# Altium project PCB_Project.PrjPcb
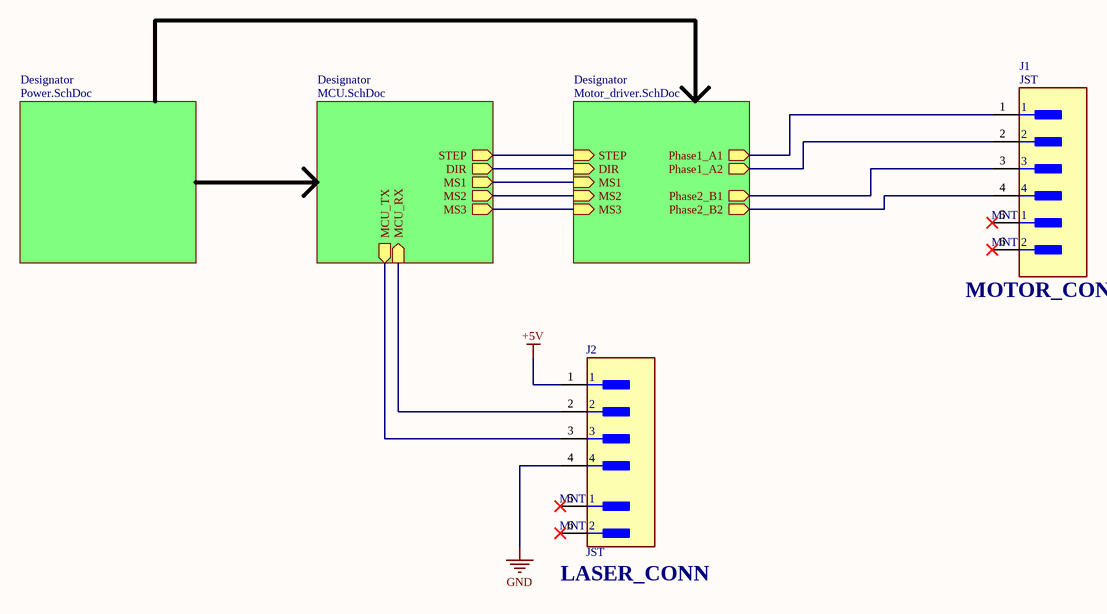
[diagram p0: TOP.SchDoc]
4 sheets, 48 parts. Net scope: hierarchical (ports join the sheet entries above them; power ports are global).
Board file: PCB2.PcbDoc
Sheets:
  TOP.SchDoc
    Designator = Power.SchDoc
    Designator = MCU.SchDoc
    Designator = Motor_driver.SchDoc

## Sheet TOP.SchDoc
size A4; SheetNumber: 1; SheetTotal: 4

### Parts
J1  Manufacturer: JST  [FP-SM04B-PASS-TBT_LF_SN-MFG]  (hidden comment: SM04B-PASS-TBT(LF)(SN))
J2  Model: JST  [FP-B4B-PH-SM4-TBT_LF_SN-MFG]  (hidden comment: B4B-PH-SM4-TBT(LF)(SN))

### Sub-sheets
Designator = Power.SchDoc: no entries
Designator = MCU.SchDoc: STEP (out), DIR (out), MS1 (out), MS2 (out), MS3 (out), MCU_RX (in), MCU_TX (out)
Designator = Motor_driver.SchDoc: STEP (in), MS1 (in), MS2 (in), MS3 (in), DIR (in), Phase1_A1 (out), Phase1_A2 (out), Phase2_B1 (out), Phase2_B2 (out)

### Nets
+5V: J2.1
GND: J2.4
NetJ1_1: J1.1 ; sheet Designator/Phase1_A1
NetJ1_2: J1.2 ; sheet Designator/Phase1_A2
NetJ1_3: J1.3 ; sheet Designator/Phase2_B1
NetJ1_4: J1.4 ; sheet Designator/Phase2_B2
NetJ2_2: J2.2 ; sheet Designator/MCU_RX
NetJ2_3: J2.3 ; sheet Designator/MCU_TX
NetU2_9: sheet Designator/DIR, sheet Designator/DIR
NetU2_10: sheet Designator/STEP, sheet Designator/STEP
NetU2_11: sheet Designator/MS3, sheet Designator/MS3
NetU2_12: sheet Designator/MS2, sheet Designator/MS2
NetU2_13: sheet Designator/MS1, sheet Designator/MS1

Not connected (* = marked no-connect by the designer): J1 5(MNT_1)* 6(MNT_2)*; J2 5(MNT_1)* 6(MNT_2)*

### Notes on the sheet
- (near J1) MOTOR_CONN
- (near J2) LASER_CONN

### Library data of the parts
J1 = CMP-2000-07078-2: CONN HEADER SMD R/A 4POS 2MM; Voltage Rating: 250V; Current Rating: 3A; Conn Gender: Male; Conn Orientation: Right Angle; Number Of Contacts: 4; Height: 5.7mm; Contact Material: Tin; Device Class L2: Headers and Wire Housings; Number Of Rows: 1; Device Class L1: Connectors; RoHS: TRUE; Lead Free: Yes; Automotive: No; Digikey Description: CONN HEADER SMD R/A 4POS 2MM; Manufacturer Part Number: SM04B-PASS-TBT(LF)(SN); Temperature: -25°C to +85°C; Package: SM04B-PASS-TBT(LF)(SN); Temperature Range Low: -25°C; ComponentLink2Description: Datasheet; Temperature Range High: +85°C; Pitch: 2mm; ComponentLink2URL: http://www.jst-mfg.com/product/pdf/eng/ePA-F.pdf; Octopart: https://octopart.com/sm04b-pass-tbt%28lf%29%28sn%29-jst-3990422; Category: Conn; Device Class L3: unset
J2 = CMP-17439-000271-1: CONN HEADER SMD 4POS 2MM; Voltage Rating: 100V; Contact Resistance: 20mR; Mated Stacking Heights: 8.6mm; Number of Positions: 4; Max Current Rating: 2A; Color: Natural; Connector Type: Header; Mount: Surface Mount; Contact Finish - Mating: TIN; Contact Material: Copper Alloy; Contact Mating Length: 0.13inch; Contact Plating: Copper; Max Operating Temperature: 85°C; Termination: Solder; Fastening Type: Detent; Min Operating Temperature: -25°C; Contact Shape: Square; Flammability Rating: UL94 V-0; Housing Material: Polyamide; Contact Type: Male Pin; Housing Color: Beige; Depth: 5mm; Packaging: Tape and Reel; Number of Rows: 1; Insulation Color: Natural; Length: 11.95mm; Max Voltage Rating (AC): 100V; Orientation: Straight; Insulation Material: Nylon; Pitch: 2mm; Package Quantity: 1; Series: PH; Lead Free: Lead Free

## Sheet Power.SchDoc
size A4; SheetNumber: 2; SheetTotal: 4
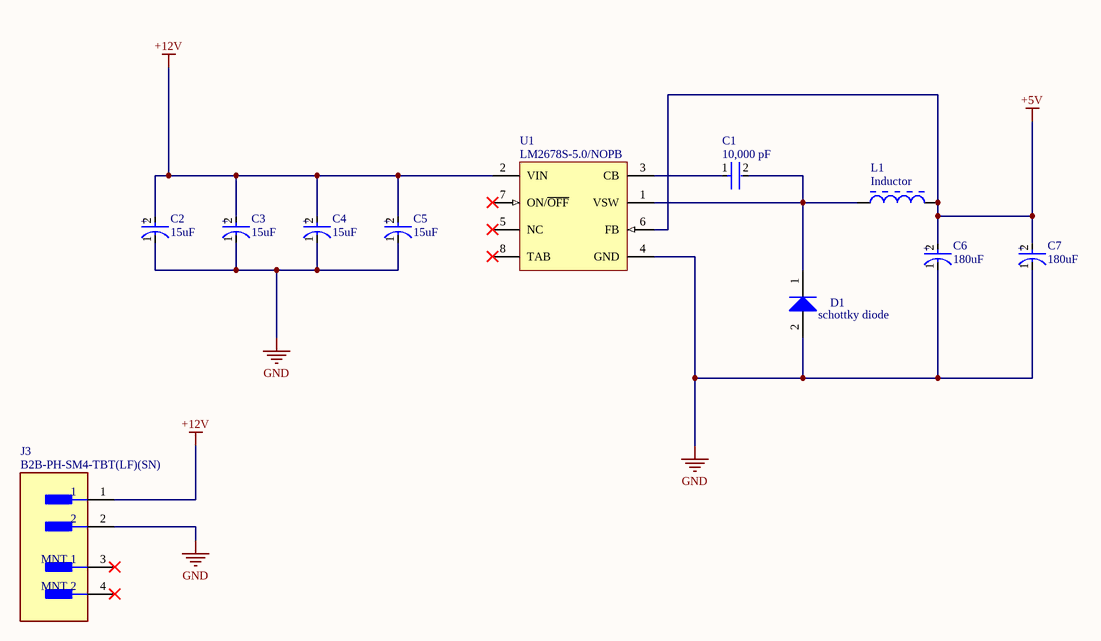
[diagram p1: Power.SchDoc]

### Parts
C1  value 10,000 pF  [FP-C0805C-DN-MFG]  (hidden comment: C0805C103K1RACTU)
C2  Capacitance: 15uF  [FP-TAJS-MFG]  (hidden comment: TAJS156K006RNJ)
C3  Capacitance: 15uF  [FP-TAJS-MFG]  (hidden comment: TAJS156K006RNJ)
C4  Capacitance: 15uF  [FP-TAJS-MFG]  (hidden comment: TAJS156K006RNJ)
C5  Capacitance: 15uF  [FP-TAJS-MFG]  (hidden comment: TAJS156K006RNJ)
C6  Capacitance: 180uF  [FP-SP-Cap-X-MFG]  (hidden comment: EEFSX0D181ER)
C7  Capacitance: 180uF  [FP-SP-Cap-X-MFG]  (hidden comment: EEFSX0D181ER)
D1  Model: schottky diode  [INF-SOD323_V]  (hidden comment: BAS3010B-03W)
J3  B2B-PH-SM4-TBT(LF)(SN)  [FP-B2B-PH-SM4-TBT_LF_SN-MFG]
L1  Model: Inductor  [BOUR-SRN3015-2_V]  (hidden comment: SRN3015-220M)
U1  LM2678S-5.0/NOPB  [KTW0007B_L]

### Nets
+5V: C6.2(A) C7.2(A) L1.2 U1.6(FB)
+12V: C2.2(A) C3.2(A) C4.2(A) C5.2(A) J3.1 U1.2(VIN)
GND: C2.1(C) C3.1(C) C4.1(C) C5.1(C) C6.1(C) C7.1(C) D1.2(A) J3.2 U1.4(GND)
NetC1_1: C1.1 U1.3(CB)
NetC1_2: C1.2 D1.1(K) L1.1 U1.1(VSW)

Not connected (* = marked no-connect by the designer): J3 3(MNT_1)* 4(MNT_2)*; U1 5(NC)* 7(ON/~{OFF})* 8(TAB)*

### Notes on the sheet
- (in symbol CMP-04424-000383-1) +
- (in symbol CMP-05428-000369-1) +

### Library data of the parts
C1 = CMP-03020-018902-1: CAP CER 10000PF 100V X7R 0805; Manufacturer: KEMET; Material: Ceramic; Temperature Coefficient: 30ppm/°C; Tolerance: 0.1; Octopart: https://octopart.com/c0805c103k1ractu-kemet-97824; Capacitance: 10,000 pF; Ipc Land Pattern Name: CAPC200125X78; Temperature: -55°C to +125°C; Temperature Range High: +125°C; Temperature Range Low: -55°C; Category: Cap; Voltage Rating: 100 V; ComponentLink2Description: Datasheet; Device Class L3: Ceramic Capacitors; ComponentLink2URL: https://content.kemet.com/datasheets/KEM_C1003_C0G_SMD.pdf; Automotive: No; Temperature Characteristic: X7R; Digikey Description: CAP CER 10000PF 100V X7R 0805; Package: C0805C-DN; Height: 0.88mm; Device Class L2: Capacitors; Mouser Description: Cap Ceramic 0.01uF 100V X7R 10% SMD 0805 125°C Paper T/R; Device Class L1: Passive Components; Lead Free: Yes; RoHS: TRUE; Manufacturer Part Number: C0805C103K1RACTU
C2-C5 = CMP-04424-000383-1: 15uF 6.3V  ±10% 3.5Ω 1206  SMD Tantalum Capacitor; Dissipation Factor: 8%; Leakage Current: 900nA; Polarity: Polar; ESR (Equivalent Series Resistance): 4R; Voltage Rating (DC): 6.3V; Weight: 0.000571oz; Max Operating Temperature: 125°C; Voltage Rating: 6.3V; Number of Pins: 2; Construction: Flat; Termination: SMD/SMT; Depth: 1.6mm; Width: 0.063inch; Series: TAJ; Packaging: Tape and Reel; Package Quantity: 1; Case Code (Imperial): 1206; Tolerance: 10%; Radiation Hardening: No; Features: General Purpose; Min Operating Temperature: -55°C; Height - Seated (Max): 0.047inch; RoHS Compliant: Yes; Length: 3.2mm; Case Code (Metric): 3216; Case/Package: 1206; Dielectric Material: Tantalum; Height: 1.2mm; Lead Free: Lead Free; Mount: Surface Mount; Voltage: 6.3V; Resistance: 4R
C6 C7 = CMP-05428-000369-1: Molded Aluminum Polymer Capacitor 180uF 20% 2V life 2000Hours SMD 2917; ESR (Equivalent Series Resistance): 9mR; Life (Hours): 1000Hour; Ripple Current: 3A; Dielectric Material: Aluminium; Dissipation Factor: 0.06%; Leakage Current: 36uA; Max Operating Temperature: 105°C; Packaging: Tape and Reel; Case Code (Metric): 7343; Package Quantity: 3500; Voltage Rating (DC): 2V; Mount: Surface Mount; RoHS Compliant: Yes; Termination: SMD/SMT; Depth: 4.3mm; Voltage: 2V; Series: SP-Cap SX; Ripple Current (AC): 3A; Height - Seated (Max): 0.083inch; Voltage Rating: 2V; Length: 7.3mm; Construction: Flat; Case Code (Imperial): 2917; Min Operating Temperature: -40°C; Height: 1.9mm; Number of Pins: 2; Case/Package: 2917; Width: 4.3mm; Tolerance: 20%
D1 = CMP-1183-00005-1: Medium Power AF Schottky Diode, -65 to 125 degC, SOD323, Reel, Green; Manufacturer: Infineon; CT (max): 40Â pF; Configuration: Single; VR (max): 30Â V; Green: TRUE; IF (max): 1,000Â mA; VF (max): 550Â mV; PackageReference: SOD323; ComponentLink1URL: http://www.infineon.com/; ComponentLink1Description: Manufacturer URL; Mounting Technology: Surface Mount; Packing: Reel; ComponentLink3Description: Package Specification; PackageDescription: 2-Pin Small Outline Diode Package, 1.25 x 1.7 mm Body; ComponentLink2Description: Datasheet; ComponentLink3URL: http://www.infineon.com/dgdl/SOD323-Package_Overview.pdf?folderId=db3a30431936bc4b011952aab84f3bbe&fileId=db3a30431936bc4b011952beed653be3; ComponentLink2URL: http://www.infineon.com/dgdl/bas3010bseries.pdf?folderId=db3a304313d846880113def5812204a1&fileId=db3a304313e278750113e29a03a70005; PartNumber: BAS3010B-03W
J3 = CMP-17439-000005-1: CONN HEADER SMD 2POS 2MM; Manufacturer: JST; Current Rating: 2A; Conn Gender: Male; Voltage Rating: 100V; Conn Orientation: Vertical; Number Of Contacts: 2; Octopart: https://octopart.com/b2b-ph-sm4-tbt%28lf%29%28sn%29-jst-7877930; Number Of Rows: 1; Device Class L2: Headers and Wire Housings; RoHS: TRUE; Contact Material: Tin,Copper; Height: 6.65mm; Temperature: -25°C to +85°C; Temperature Range Low: -25°C; ComponentLink2Description: Datasheet; Manufacturer Part Number: B2B-PH-SM4-TBT(LF)(SN); ComponentLink2URL: http://www.jst-mfg.com/product/pdf/eng/ePH.pdf; Automotive: No; Pitch: 2mm; Lead Free: Yes; Device Class L3: unset; Category: Conn; Digikey Description: CONN HEADER SMD 2POS 2MM; Temperature Range High: +85°C; Package: 0; Device Class L1: Connectors
L1 = CMP-0007-00013-1: Semi-shielded Power Inductor, 22 uH, +/- 20%, 0.6 A, -40 to 125 degC, 3 x 3 x 1.5 mm SMD, RoHS and Halogen Free, Tape and Reel; Manufacturer: Bourns; SRF Min: 28 MHz; Isat: 0.58 A; Resistance to Solder Heat: +260 degC for 10 sec.; Inductance tolerance: +/- 20%; Inductance: 22 uH; Rated current: 0.6 A; DCR Max: 0.622 Ohm; RoHS: TRUE; ComponentLink1Description: Manufacturer URL; ComponentLink3URL: http://www.bourns.com/data/global/pdfs/SRN3015.pdf; PartNumber: SRN3015-220M; DatasheetVersion: Aug-11; Mounting Technology: Surface Mount; ComponentLink3Description: Package Specification; ComponentLink2Description: Datasheet; Operating Temperature: -40 to 125 degC; PackageDescription: 2-Pin SMD, Body 3 x 3 mm, Height 1.5 mm; Packing: Tape and Reel; PackageReference: SRN3015; ComponentLink2URL: http://www.bourns.com/data/global/pdfs/SRN3015.pdf; ComponentLink1URL: http://www.bourns.com/
U1 = CMP-0069-00189-3: SIMPLE SWITCHER® High Efficiency 5A Step-Down Voltage Regulator, 7-pin TO-263, Pb-Free; Manufacturer: Texas Instruments; PackageTopMarking: NSUZXYTTE#*LM2678*S-5.0; PowerWise: N; PackageReference: KTW0007B; RoHS: Y; ComponentLink1URL: http://www.ti.com/general/docs/lit/getliterature.tsp?genericPartNumber=LM2678&fileType=pdf; ComponentLink1Description: Datasheet URL; PackageDescription: TO-263, Molded, .400 x .390 x .180in Body, 7 Lead, .050in Pitch, Surface Mount; Code_JEDEC: MO-169-AC; PinCount: 7; CompType: Switcher

## Sheet MCU.SchDoc
size A4; SheetNumber: 4; SheetTotal: 4
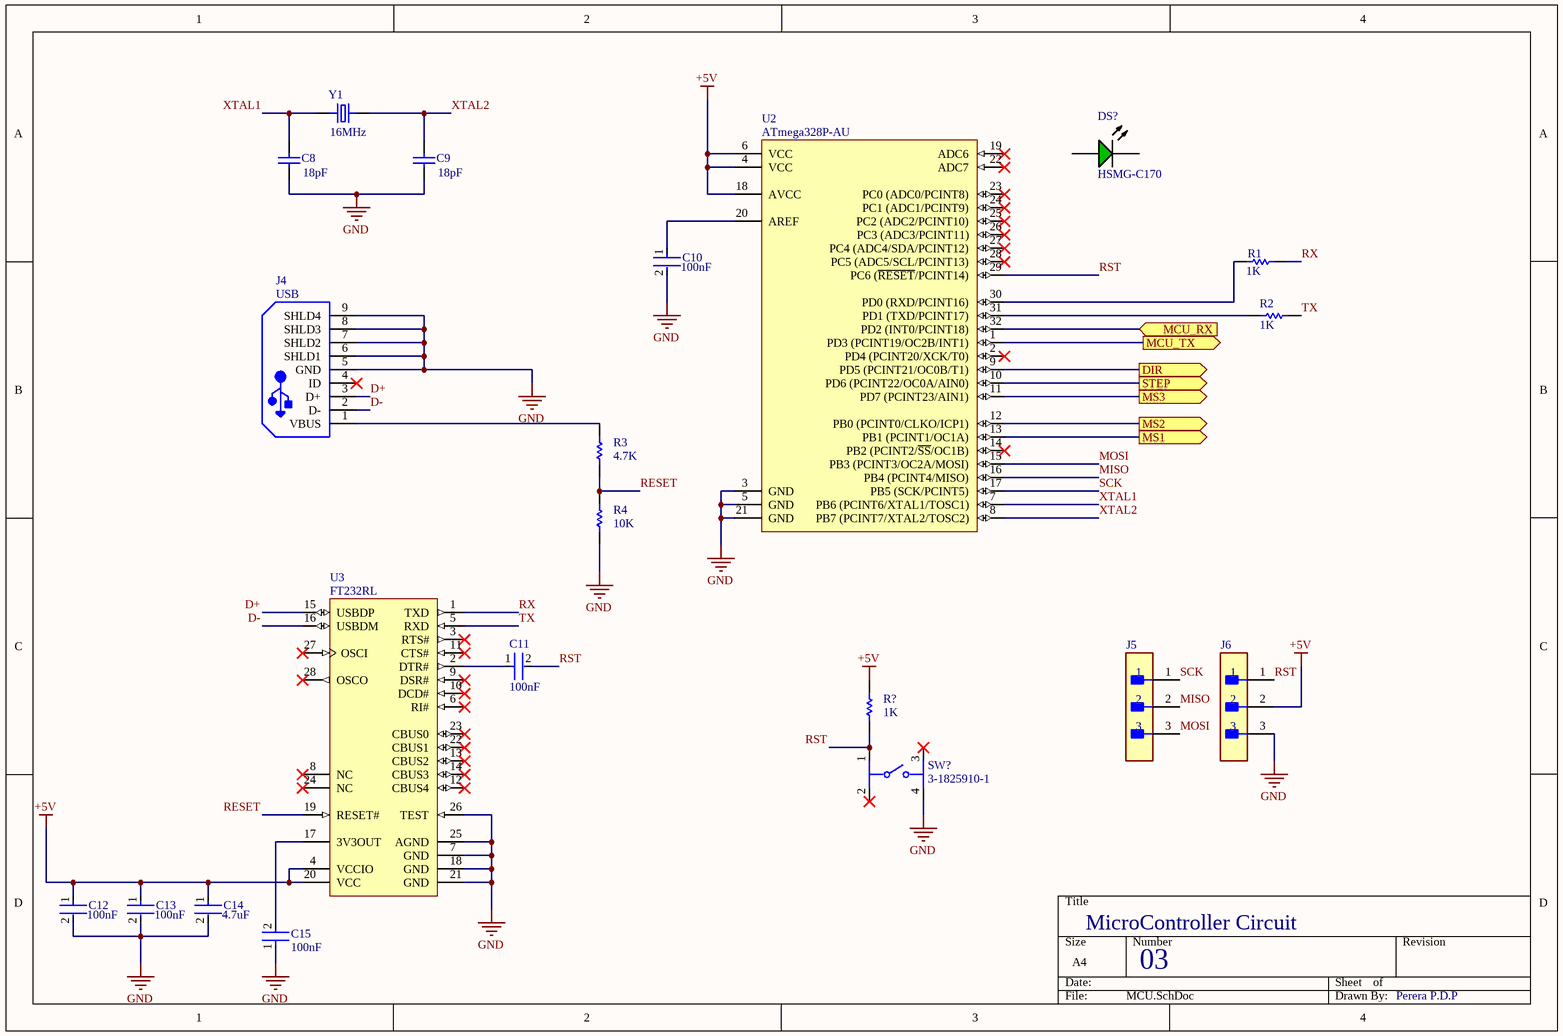
[diagram p2: MCU.SchDoc]

### Parts
C8  value 18pF  [CAPC2013X115X51ML20T26]  (hidden comment: 08052U180GAT2A)
C9  value 18pF  [CAPC2013X115X51ML20T26]  (hidden comment: 08052U180GAT2A)
C10  Capacitance: 100nF  [FP-0805-L_2_01_0_2-W_1_25-IPC_B]  (hidden comment: 08051C104KAT2A)
C11  Capacitance: 100nF  [FP-0805-L_2_01_0_2-W_1_25-IPC_B]  (hidden comment: 08051C104KAT2A)
C12  Capacitance: 100nF  [FP-0805-L_2_01_0_2-W_1_25-IPC_B]  (hidden comment: 08051C104KAT2A)
C13  Capacitance: 100nF  [FP-0805-L_2_01_0_2-W_1_25-IPC_B]  (hidden comment: 08051C104KAT2A)
C14  Capacitance: 4.7uF  [FP-0805-L_2_01_0_2-W_1_25-MFG]  (hidden comment: 0805YC475KAT2A)
C15  Capacitance: 100nF  [FP-0805-L_2_01_0_2-W_1_25-IPC_B]  (hidden comment: 08051C104KAT2A)
DS?  HSMG-C170  [AVAG-HSMX-C170_V]
J4  Model: USB  [MOLX-56579-0576_V]  (hidden comment: 56579-0576)
J5  NRPN031PAEN-RC  [FP-NRPN031PAEN-RC-MFG]  (value not drawn)
J6  NRPN031PAEN-RC  [FP-NRPN031PAEN-RC-MFG]  (value not drawn)
R1  value 1K  [RESC2013X60X35NL10T20]  (hidden comment: RT0805BRD071KL)
R2  value 1K  [RESC2013X60X35NL10T20]  (hidden comment: RT0805BRD071KL)
R3  value 4.7K  [RESC2013X60X40ML20T25]  (hidden comment: ERA6AEB472V)
R4  value 10K  [RESC2013X60X40NL15T20]  (hidden comment: CRCW080510K0FKEAHP)
R?  value 1K  [RESC2013X60X35NL10T20]  (hidden comment: RT0805BRD071KL)
SW?  3-1825910-1  [FP-3-1825910-1-MFG]
U2  ATmega328P-AU  [32A_M]
U3  FT232RL  [FTDI-SSOP-28_M]
Y1  value 16MHz  [XTAL_ECS-160-S-5PX-TR]  (hidden comment: ECS-160-S-5PX-TR)

### Ports
DIR (out, see TOP[2B], Motor_driver[1B]), MCU_RX (in, see TOP[2C]), MCU_TX (out, see TOP[2C]), MS1 (out, see TOP[2B], Motor_driver[1B]), MS2 (out, see TOP[2B], Motor_driver[1B]), MS3 (out, see TOP[2B], Motor_driver[1B]), STEP (out, see TOP[2B], Motor_driver[1B])

### Nets
+5V: C12.1 C13.1 C14.1 J6.2 R?.2 U2.4(VCC) U2.6(VCC) U2.18(AVCC) U3.4(VCCIO) U3.20(VCC)
GND: C8.1 C9.1 C10.2 C12.2 C13.2 C14.2 C15.1 J4.5(GND) J4.6(SHLD1) J4.7(SHLD2) J4.8(SHLD3) J4.9(SHLD4) J6.3 R4.1 SW?.4 U2.3(GND) U2.5(GND) U2.21(GND) U3.7(GND) U3.18(GND) U3.21(GND) U3.25(AGND) U3.26(TEST)
D+: J4.3(D+) U3.15(USBDP)
D-: J4.2(D-) U3.16(USBDM)
MISO: J5.2 U2.16(PB4_(PCINT4/MISO))
MOSI: J5.3 U2.15(PB3_(PCINT3/OC2A/MOSI))
RESET: R3.1 R4.2 U3.19(RESET#)
RST: C11.2 J6.1 R?.1 SW?.1 U2.29(PC6_(~{RESET}/PCINT14))
RX: R1.1 U3.1(TXD)
SCK: J5.1 U2.17(PB5_(SCK/PCINT5))
TX: R2.1 U3.5(RXD)
XTAL1: C8.2 U2.7(PB6_(PCINT6/XTAL1/TOSC1)) Y1.1
XTAL2: C9.2 U2.8(PB7_(PCINT7/XTAL2/TOSC2)) Y1.2
NetC10_1: C10.1 U2.20(AREF)
NetC11_1: C11.1 U3.2(DTR#)
NetC15_2: C15.2 U3.17(3V3OUT)
NetJ2_2: U2.32(PD2_(INT0/PCINT18)) ; port MCU_RX
NetJ2_3: U2.1(PD3_(PCINT19/OC2B/INT1)) ; port MCU_TX
NetJ4_1: J4.1(VBUS) R3.2
NetR1_2: R1.2 U2.30(PD0_(RXD/PCINT16))
NetR2_2: R2.2 U2.31(PD1_(TXD/PCINT17))
NetU2_9: U2.9(PD5_(PCINT21/OC0B/T1)) ; port DIR
NetU2_10: U2.10(PD6_(PCINT22/OC0A/AIN0)) ; port STEP
NetU2_11: U2.11(PD7_(PCINT23/AIN1)) ; port MS3
NetU2_12: U2.12(PB0_(PCINT0/CLKO/ICP1)) ; port MS2
NetU2_13: U2.13(PB1_(PCINT1/OC1A)) ; port MS1

Not connected (* = marked no-connect by the designer): DS? 1(A) 2(K); J4 4(ID)*; SW? 2* 3*; U2 2(PD4_(PCINT20/XCK/T0))* 14(PB2_(PCINT2/~{SS}/OC1B))* 19(ADC6)* 22(ADC7)* 23(PC0_(ADC0/PCINT8))* 24(PC1_(ADC1/PCINT9))* 25(PC2_(ADC2/PCINT10))* 26(PC3_(ADC3/PCINT11))* 27(PC4_(ADC4/SDA/PCINT12))* 28(PC5_(ADC5/SCL/PCINT13))*; U3 3(RTS#)* 6(RI#)* 8(NC)* 9(DSR#)* 10(DCD#)* 11(CTS#)* 12(CBUS4)* 13(CBUS2)* 14(CBUS3)* 22(CBUS1)* 23(CBUS0)* 24(NC)* 27(OSCI)* 28(OSCO)*

### Notes on the sheet
- MicroController Circuit
- 03
- Perera P.D.P

### Library data of the parts
C8 C9 = CMP-2007-04887-1: Manufacturer: AVX Interconnect / Elco; Part Number: 08052U180GAT2A
C10-C13 C15 = CMP-2007-04174-2: General Purpose Ceramic Capacitor, 0805, 100nF, 10%, X7R, 15%, 100V; Packaging: Tape and Reel; Min Operating Temperature: -55°C; Dielectric Material: Ceramic; Height: 1.4mm; Voltage Rating: 100V; Termination: SMD/SMT; Case Code (Imperial): 0805; Case Code (Metric): 2012; Case/Package: 0805; Construction: Flat; Radiation Hardening: No; Series: -; Dielectric: X7R; Package Quantity: 2000; Mount: Surface Mount; Contact Plating: Tin; Voltage: 100V; Lead Free: Lead Free; Depth: 1.25mm; RoHS Compliant: Yes; Number of Pins: 2; Max Operating Temperature: 125°C; Length: 2.01mm; Voltage Rating (DC): 100V; Thickness: 0.055inch; REACH SVHC: No SVHC; Width: 0.049inch; Tolerance: 10%
C14 = CMP-2007-04518-2: General Purpose Ceramic Capacitor, 0805, 4.7uF, 10%, X7R, 15%, 16V; Dissipation Factor: 3.5%; Voltage: 10V; Height: 1.52mm; Package Quantity: 1; Voltage Rating: 16V; RoHS Compliant: Yes; Mount: Surface Mount; REACH SVHC: No SVHC; Number of Pins: 2; Packaging: Tape and Reel; Radiation Hardening: No; Thickness: 0.06inch; Width: 0.049inch; Length: 2.01mm; Termination: SMD/SMT; Case Code (Metric): 2012; Max Operating Temperature: 125°C; Construction: Flat; Series: -; Depth: 1.25mm; Voltage Rating (DC): 16V; Dielectric: X7R; Contact Plating: Tin; Tolerance: 10%; Lead Free: Lead Free; Min Operating Temperature: -55°C; Case Code (Imperial): 0805; Case/Package: 0805; Value: *
DS? = CMP-2000-05062-1: Chip LED, Green, 2.2 V, -40 to 85 degC, 2-Pin SMD, Pb-Free, Tape and Reel; Manufacturer: Avago; No. of Pins: 2; Peak Wavelength: 570nm; SVHC: NoSVHC(16-Jun-2014); Dominant Wavelength: 572nm; Forward Current If: 20mA; Viewing Angle: 170deg; Lens Shape: Rectangular; PIV Max: 5V; External Width: 1.25mm; LED Type: Standard; External Depth: 0.8mm; Opto Mounting Orientation: Top; Luminous Intensity: 15mcd; Luminous Intensity Min: 4mcd; Forward Voltage VF Max: 2.6V; External Length / Height: 2mm; Bulb Size: 1.25mmx1.4mm; Light Area Height: 1mm; Voltage Vf Typ: 2.2V; Operating Temperature Max: 85degC; Datasheet Version: Oct-08; MSL: MSL2A-4weeks; Peak Forward Current: 20mA; Package Description: 2-Pin Surface Mount Device, Body 2 x 1.25 mm, Height 0.8 mm; Datasheet URL: https://datasheet.ciiva.com/29280/180495-da-01-en-chip-led-hsmg-c170-gelb-gruen-29280971.pdf; Storage Temperature Min: -40degC; LED Colour: Green; Wavelength Typ: 570nm; Mounting Type: SMD; Forward Current If Max: 20mA; Dominant Wavelength Typ: 572nm; LED Mounting: SMD; Operating Temperature Range: -30degCto+85degC; Operating Temperature Min: -30degC; Manufacturer URL: http://www.avagotech.com/; Packaging: CutTape; Luminous Intensity Typ: 15mcd; Package Reference: HSMX-C170; Storage Temperature Max: 85degC; Opto Case Style: SMD; Forward Voltage: 2.2V
J4 = CMP-2000-05643-1: USB Connector, 30 V, 1 A, 0 to 50 degC, 5-Pin SMD, RoHS, Tape and Reel; Brand: Molex; Insulation Resistance: 100MOhms; Connector Type: MiniUSBTypeABReceptacle; Mounting Angle: Right; Number of Ports: 1Port; Gender: Female; Voltage Rating: 30VAC/DC; Number of Contacts: 5Contact; Current Rating: 1A; Package Reference: 56579-0576; Package Description: 5-Pin Surface Mount Device, Body 9.9 x 9 mm, Pitch 0.8 mm; Color: Gray; Manufacturer URL: http://www.molex.com/; Product: MiniUSBTypeABConnectors; Factory Pack Quantity: 800; Standard: USB; Termination Style: SolderTab; Contact Plating: Gold; Product Category: USBConnectors; Datasheet Version: Rev. E, 04/2006; Operating Temperature Range: 0Cto+50C; RoHS: Details; Manufacturer: Molex; Features: MetalshieldingforESDprotection; Mounting Technology: SurfaceMount; Flammability Rating: UL94V-0; Datasheet URL: http://www.molex.com/pdm_docs/sd/565790576_sd.pdf; Series: 56579; Contact Material: CopperAlloy; Packaging: Reel
J5 J6 = CMP-25680-000021-1: CONN HEADER VERT 3POS 2MM; Manufacturer: Sullins; Number Of Contacts: 3; Conn Orientation: Straight; Voltage Rating: 150V; Conn Gender: Male; Current Rating: 2A; Temperature Range High: +105°C; Category: Conn; Manufacturer Part Number: NRPN031PAEN-RC; RoHS: TRUE; Contact Material: Gold,Nickel; ComponentLink2URL: https://drawings-pdf.s3.amazonaws.com/10531.pdf; Temperature: -40°C to +105°C; Lead Free: Yes; Octopart: https://octopart.com/nrpn031paen-rc-sullins-12817732; ComponentLink2Description: Datasheet; Pitch: 2mm; Number Of Rows: 1; Automotive: No; Height: 6mm; Device Class L2: Headers and Wire Housings; Digikey Description: CONN HEADER VERT 3POS 2MM; Package: 0; Device Class L3: unset; Temperature Range Low: -40°C; Device Class L1: Connectors
R1 R2 R? = CMP-2001-01453-1: Manufacturer: Yageo; Part Number: RT0805BRD071KL
R3 = CMP-2001-00644-1: Manufacturer: Panasonic; Part Number: ERA6AEB472V
R4 = CMP-2001-04472-1: Manufacturer: Vishay Dale; Part Number: CRCW080510K0FKEAHP
SW? = CMP-03407-000001-1: SWITCH TACTILE SPST-NO 0.05A 24V; Manufacturer: TE Connectivity; Operating Force: 160gf; Contact Current Rating: 50mA; Description: Switch Tactile OFF (ON) SPST Round Button PC Pins 0.05A 24VDC 100000Cycles 1.57N Thru-Hole; Contact Resistance: 100mΩ; Electromechanical Life: 100000Cycles; Device Class L1: Electromechanical; ComponentLink2URL: https://www.te.com/commerce/DocumentDelivery/DDEController?Action=srchrtrv&DocNm=1825910&DocType=Customer+Drawing&DocLang=English; Category: Switch; Device Class L2: Switches; Temperature: -35°C to +85°C; RoHS: TRUE; Mount: Through Hole; Manufacturer Part Number: 3-1825910-1; Automotive: No; Lead Free: Yes; Device Class L3: Tactile Switches; ComponentLink2Description: Datasheet; Temperature Range High: +85°C; Height: 17.3mm; Package: 0; Temperature Range Low: -35°C; Throw Configuration: SPST-NO; Digikey Description: SWITCH TACTILE SPST-NO 0.05A 24V; Octopart: https://octopart.com/3-1825910-1-te+connectivity-46506874
U2 = CMP-0095-00269-2: 8-bit AVR Microcontroller, 32KB Flash, 1KB EEPROM, 2KB SRAM, 32-pin TQFP, Industrial Grade (-40°C to 85°C); PackageDescription: 32-Lead, 7x7x1.0 mm Body, 0.8mm Lead Pitch, Thin Profile Plastic Quad Flat Package (TQFP); DatasheetVersion: revD, May-2011; RevisionNote: DatasheetVersion & PackageVersion updated. URLs added.; ComponentLink1URL: http://www.atmel.com/; ComponentLink2Description: ATmega48A/48PA/88A/88PA/168A/168PA/328/328P Datasheet; Code_JEDEC: MS-026-ABA; ComponentLink1Description: Manufacturer URL; PackageReference: 32A; ComponentLink3Description: ATmega48A/48PA/88A/88PA/168A/168PA/328/328P Summary; ComponentLink2URL: http://www.atmel.com/dyn/resources/prod_documents/doc8271.pdf; PackageVersion: revC, Oct-2010; ComponentLink3URL: http://www.atmel.com/dyn/resources/prod_documents/8271S.pdf
U3 = CMP-2000-05029-1: IC USB FS SERIAL UART 28-SSOP; Manufacturer: FTDI; Receive FIFO: 256B; Number of Channels per Chip: 1; Maximum Data Rate: 3MBd; Transmit FIFO: 128B; Dimensions: 10.2x5.3x1.75mm; Mounting Type: SurfaceMount; Height: 1.75mm; Package Type: SSOP; Datasheet Version: Rev. 1.04, 02/2006; Width: 5.3mm; Manufacturer URL: http://www.ftdichip.com/; Datasheet URL: http://datasheet.octopart.com/FT232RL-FTDI-datasheet-120501.pdf; Maximum Operating Temperature: +85degC; Minimum Operating Temperature: -40degC; Pin Count: 28; Length: 10.2mm
Y1 = ECS-160-S-5PX-TR: 16MHz Â±30ppm Crystal Series 40 Ohms HC-49/US; MF: ECS Inc.; MP: ECS-160-S-5PX-TR; Package: HC49/US ECS International; Price: None; Availability: Unavailable; SnapEDA_Link: https://www.snapeda.com/parts/ECS-160-S-5PX-TR/ECS%20Inc./view-part/2457269/?ref=snap; Parameter 1: *

## Sheet Motor_driver.SchDoc
size A4; SheetNumber: 3; SheetTotal: 4
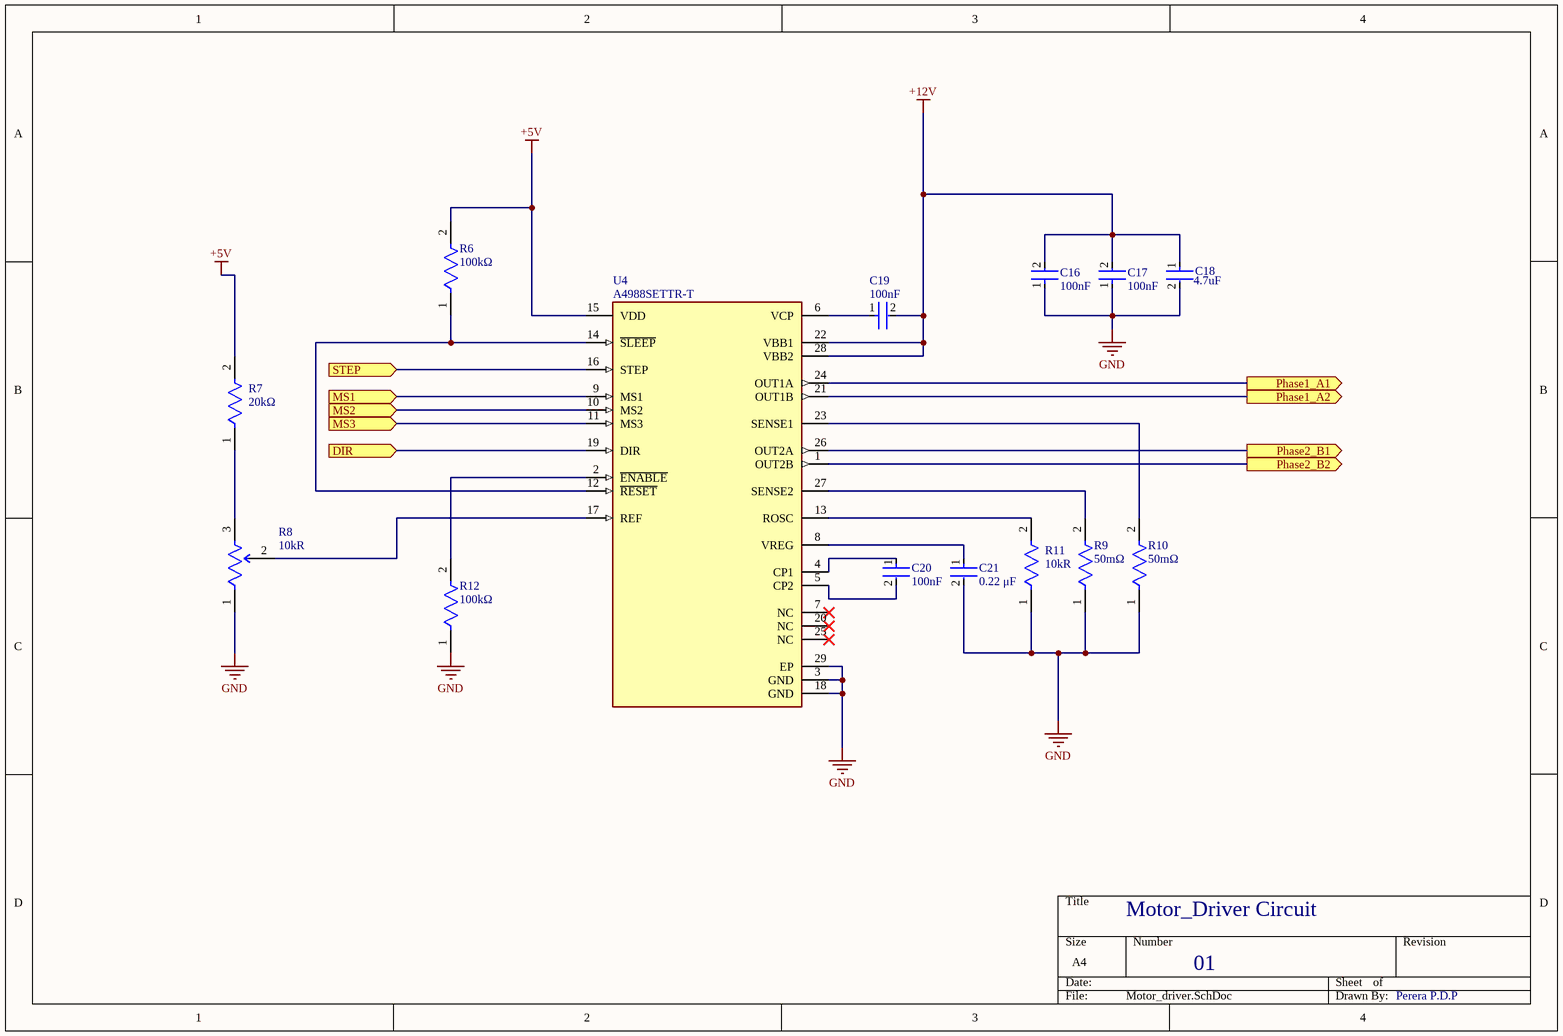
[diagram p3: Motor_driver.SchDoc]

### Parts
C16  Capacitance: 100nF  [FP-0805-L_2_01_0_2-W_1_25-IPC_C]  (hidden comment: 08055C104KAT2A)
C17  Capacitance: 100nF  [FP-0805-L_2_01_0_2-W_1_25-IPC_C]  (hidden comment: 08055C104KAT2A)
C18  Capacitance: 4.7uF  [FP-0805-L_2_01_0_2-W_1_25-MFG]  (hidden comment: 0805YC475KAT2A)
C19  Capacitance: 100nF  [FP-0805-L_2_01_0_2-W_1_25-IPC_C]  (hidden comment: 08055C104KAT2A)
C20  Capacitance: 100nF  [FP-0805-L_2_01_0_2-W_1_25-IPC_C]  (hidden comment: 08055C104KAT2A)
C21  value 0.22 μF  [FP-C0805C-DN-MFG]  (hidden comment: C0805C224K5RACTU)
R6  Resistance: 100kΩ  [FP-RC0805-0_6-IPC_C]  (hidden comment: RC0805FR-07100KL)
R7  Resistance: 20kΩ  [FP-ERA6A-MFG]  (hidden comment: ERA6AEB203V)
R8  Resistance: 10kR  [FP-3361P-MFG]  (hidden comment: 3361P-1-103GLF)
R9  Resistance: 50mΩ  [FP-WSL2512-MFG]  (hidden comment: WSL2512R0500FEA)
R10  Resistance: 50mΩ  [FP-WSL2512-MFG]  (hidden comment: WSL2512R0500FEA)
R11  Resistance: 10kR  [FP-CRCW0805-e3-IPC_A]  (hidden comment: CRCW080510K0FKEA)
R12  Resistance: 100kΩ  [FP-RC0805-0_6-IPC_C]  (hidden comment: RC0805FR-07100KL)
U4  A4988SETTR-T  [FP-ET-28-MFG]

### Ports
DIR (in, see TOP[3B], MCU[3B]), MS1 (in, see TOP[3B], MCU[3B]), MS2 (in, see TOP[3B], MCU[3B]), MS3 (in, see TOP[3B], MCU[3B]), Phase1_A1 (out, see TOP[3B]), Phase1_A2 (out, see TOP[3B]), Phase2_B1 (out, see TOP[3B]), Phase2_B2 (out, see TOP[3B]), STEP (in, see TOP[3B], MCU[3B])

### Nets
+5V: R6.2 R7.2 U4.15(VDD)
+12V: C16.2 C17.2 C18.1 C19.2 U4.22(VBB1) U4.28(VBB2)
GND: C16.1 C17.1 C18.2 C21.2 R8.1(CCW) R9.1 R10.1 R11.1 R12.1 U4.3(GND) U4.18(GND) U4.29(EP)
NetC19_1: C19.1 U4.6(VCP)
NetC20_1: C20.1 U4.4(CP1)
NetC20_2: C20.2 U4.5(CP2)
NetC21_1: C21.1 U4.8(VREG)
NetJ1_1: U4.24(OUT1A) ; port Phase1_A1
NetJ1_2: U4.21(OUT1B) ; port Phase1_A2
NetJ1_3: U4.26(OUT2A) ; port Phase2_B1
NetJ1_4: U4.1(OUT2B) ; port Phase2_B2
NetR6_1: R6.1 U4.12(~{RESET}) U4.14(~{SLEEP})
NetR7_1: R7.1 R8.3(CW)
NetR8_2: R8.2(WIPER) U4.17(REF)
NetR9_2: R9.2 U4.27(SENSE2)
NetR10_2: R10.2 U4.23(SENSE1)
NetR11_2: R11.2 U4.13(ROSC)
NetR12_2: R12.2 U4.2(~{ENABLE})
NetU2_9: U4.19(DIR) ; port DIR
NetU2_10: U4.16(STEP) ; port STEP
NetU2_11: U4.11(MS3) ; port MS3
NetU2_12: U4.10(MS2) ; port MS2
NetU2_13: U4.9(MS1) ; port MS1

Not connected (* = marked no-connect by the designer): U4 7(NC)* 20(NC)* 25(NC)*

### Notes on the sheet
- Motor_Driver Circuit
- 01
- Perera P.D.P

### Library data of the parts
C16 C17 C19 C20 = CMP-2000-05016-2: General Purpose Ceramic Capacitor, 0805, 100nF, 10%, X7R, 0.15, 50V; Dissipation Factor: 2.5%; Insulation Resistance: 100GR; Voltage Rating (DC): 50V; Package Quantity: 4000; Tolerance: 10%; Voltage Rating: 50V; Dielectric: X7R; Case/Package: 0805; Lead Free: Lead Free; Dielectric Material: Ceramic; Thickness: 0.037inch; Weight: 0.001411oz; Max Operating Temperature: 125°C; REACH SVHC: No SVHC; Mount: Surface Mount; RoHS Compliant: Yes; Depth: 1.25mm; Height: 0.5mm; Case Code (Metric): 2012; Length: 2mm; Termination: Standard; Case Code (Imperial): 0805; Number of Pins: 2; Voltage: 50V; Radiation Hardening: No; Min Operating Temperature: -55°C; Width: 1.2mm; Series: MLCC X7R; Packaging: Cut Tape
C18 = CMP-2007-04518-2: as C14 on sheet MCU; Height: 1.52mm; Package Quantity: 1; Voltage Rating: 16V; RoHS Compliant: Yes; Mount: Surface Mount; REACH SVHC: No SVHC; Number of Pins: 2; Packaging: Tape and Reel; Radiation Hardening: No; Thickness: 0.06inch; Width: 0.049inch; Length: 2.01mm; Termination: SMD/SMT; Case Code (Metric): 2012; Max Operating Temperature: 125°C; Construction: Flat; Series: -; Depth: 1.25mm; Voltage Rating (DC): 16V; Dielectric: X7R; Contact Plating: Tin; Tolerance: 10%; Lead Free: Lead Free; Min Operating Temperature: -55°C; Case Code (Imperial): 0805; Case/Package: 0805
C21 = CMP-1036-04552-2: CAP CER 0.22UF 50V X7R 0805; Manufacturer: KEMET; Temperature Coefficient: 30ppm/°C; Material: Ceramic; Tolerance: 0.1; ComponentLink2URL: https://content.kemet.com/datasheets/KEM_C1003_C0G_SMD.pdf; Temperature Characteristic: X7R; Device Class L3: Ceramic Capacitors; Lead Free: Yes; Temperature: -55°C to +125°C; RoHS: TRUE; Capacitance: 0.22 μF; Automotive: No; Octopart: https://octopart.com/c0805c224k5ractu-kemet-144670; Manufacturer Part Number: C0805C224K5RACTU; Temperature Range Low: -55°C; Height: 0.88mm; Device Class L1: Passive Components; Digikey Description: CAP CER 0.22UF 50V X7R 0805; ComponentLink2Description: Datasheet; Mouser Description: CAP CER 0.22UF 50V X7R 0805; Category: Cap; Ipc Land Pattern Name: CAPC200125X78; Temperature Range High: +125°C; Package: C0805C-DN; Device Class L2: Capacitors; Voltage Rating: 50 V
R6 R12 = CMP-2100-03668-5: RES 100K OHM 1% 1/8W 0805; Power Rating: 125mW; Temperature Coefficient: 100ppm/°C; Voltage Rating (DC): 150V; Package Quantity: 1; Case/Package: 0805; Lead Pitch: 0.4mm; Case Code (Imperial): 0805; Construction: Rectangular; Number of Terminations: 2; RoHS Compliant: Yes; Max Power Dissipation: 125mW; Tolerance: 1%; Max Operating Temperature: 155°C; Resistance Tolerance: 1%; Lead Free: Lead Free; Packaging: Tape and Reel; Resistor Type: Thick Film; Min Operating Temperature: -55°C; Case Code (Metric): 2012; Series: RC; Technology: THICK FILM; Voltage Rating: 150V; Termination: SMD/SMT; Width: 0.049inch; Number of Pins: 2; Features: Moisture Resistant; Military Standard: Not; Length: 0.079inch; Depth: 1.25mm; Size Code: 0805; Height: 0.024inch
R7 = CMP-2001-00610-2: RES 20K OHM 0.1% 1/8W 0805; Power Rating: 125mW; Voltage Rating (DC): 100V; Temperature Coefficient: 25ppm/°C; REACH SVHC: No SVHC; Features: Automotive AEC-Q200; Tolerance: 0.1%; Size Code: 0805; Max Power Dissipation: 125mW; Termination: SMD/SMT; Package Quantity: 1; Resistor Type: Thin Film; Number of Pins: 2; Width: 1.25mm; Technology: THIN FILM; Min Operating Temperature: -55°C; Length: 2mm; Mount: Surface Mount; Height: 0.5mm; Resistance Tolerance: 0.1%; Military Standard: Not; Case Code (Imperial): 0805; Contact Plating: Tin; Case Code (Metric): 2012; Number of Terminations: 2; RoHS Compliant: Yes; Voltage Rating: 100V; Lead Free: Lead Free; Depth: 1.25mm; Construction: Rectangular; Case/Package: 0805; Radiation Hardening: No; Series: ERA-6A; Max Operating Temperature: 155°C; Packaging: Tape and Reel
R8 = CMP-07234-000045-1: TRIMMER 10K OHM 0.5W GW TOP ADJ; Power Rating: 500mW; Temperature Coefficient: 100ppm/°C; Tolerance: 10%; Voltage Rating (DC): 300V; Number of Turns: 1; RoHS Compliant: Yes; Technology: CERMET; Packaging: Tape and Reel; Width: 0.264inch; Weight: 0.567g; Max Operating Temperature: 125°C; REACH SVHC: No SVHC; Series: Trimpot® 3361 - Sealed; Lead Free: Lead Free; Depth: 8.53mm; Taper: Linear; Package Quantity: 1; Min Operating Temperature: -55°C; Termination: Gull Wing; Radiation Hardening: No; Height: 0.205inch; Contact Plating: Tin; Voltage Rating: 300V; Length: 6.71mm; Max Power Dissipation: 500mW; Mount: Surface Mount; Military Standard: Not; Color: Natural; Resistor Type: Cermet; Resistance Tolerance: 10%
R9 R10 = CMP-2000-07420-2: RES 0.05 OHM 1% 1W 2512; Manufacturer: Vishay; 3DS Part Number: 110-00001; Temperature Coefficient: 75ppm/°C; Automotive Grade: Grade 0; Value: 50mΩ; Automotive: Yes; Tolerance: 1%; Device Class L3: Chip SMD Resistors; Category: Res; Package: WSL2512; Lead Free: Yes; Octopart: https://octopart.com/wsl2512r0500fea-vishay-39744678; ComponentLink2URL: http://www.vishay.com/docs/30100/wsl.pdf; Height: 0.889mm; Composition: Metal Element; Temperature Range High: +170°C; ComponentLink2Description: Datasheet; Digikey Description: RES 0.05 OHM 1% 1W 2512; Series: WSL; Temperature: -65°C to +170°C; Temperature Range Low: -65°C; Manufacturer Part Number: WSL2512R0500FEA; Device Class L1: Passive Components; RoHS: TRUE; Power Rating: 1W; Ipc Land Pattern Name: RESC635318X64; Device Class L2: Resistors
R11 = CMP-2001-04908-2: RES Thick Film, 10kΩ, 1%, 0.125W, 100ppm/°C, 0805; Voltage Rating (DC): 150V; Power Rating: 125mW; Weight: 0.000194oz; Package Quantity: 5000; Military Standard: Not; Max Operating Temperature: 155°C; Temperature Coefficient: 100ppm/°C; Contact Plating: Tin; Width: 1.25mm; Height: 0.45mm; Radiation Hardening: No; Tolerance: 1%; Min Operating Temperature: -55°C; Voltage Rating: 150V; Length: 2mm; Depth: 1.25mm; Termination: SMD/SMT; Packaging: Tape and Reel; Case/Package: 0805; Case Code (Metric): 2012; Lead Free: Lead Free; Case Code (Imperial): 0805; Composition: Thick Film
U4 = CMP-1742-00003-2: IC MTR DRVR BIPOLAR 3-5.5V 28QFN; Number of Outputs: 1; Motor Type: Stepper; Output Current: 2A; Min Supply Voltage: 8V; Output Voltage: 35V; Package Quantity: 1; Max Operating Temperature: 85°C; Case/Package: QFN EP; Mount: Surface Mount; Packaging: Tape and Reel; Radiation Hardening: No; REACH SVHC: No SVHC; Min Operating Temperature: -20°C; Max Supply Voltage: 35V; Number of Pins: 28

## Nets that join several sheets
+5V: TOP (J2.1), Power (C6.2 C7.2 L1.2 U1.6), MCU (10 pins), Motor_driver (R6.2 R7.2 U4.15)
+12V: Power (6 pins), Motor_driver (6 pins)
GND: TOP (J2.4), Power (9 pins), MCU (23 pins), Motor_driver (12 pins)
NetJ1_1: TOP (J1.1), Motor_driver (U4.24)
NetJ1_2: TOP (J1.2), Motor_driver (U4.21)
NetJ1_3: TOP (J1.3), Motor_driver (U4.26)
NetJ1_4: TOP (J1.4), Motor_driver (U4.1)
NetJ2_2: TOP (J2.2), MCU (U2.32)
NetJ2_3: TOP (J2.3), MCU (U2.1)
NetU2_9: MCU (U2.9), Motor_driver (U4.19)
NetU2_10: MCU (U2.10), Motor_driver (U4.16)
NetU2_11: MCU (U2.11), Motor_driver (U4.11)
NetU2_12: MCU (U2.12), Motor_driver (U4.10)
NetU2_13: MCU (U2.13), Motor_driver (U4.9)